# Altium schematic sheet RGMII_PHY.SchDoc: RGMII PHY
size A4; DrawnBy: ThanhQuoc; Revision: V01; SheetNumber: 19; SheetTotal: 21; Project: RV1126 CAMERA BOARD DESIGN; SPICEModelCachePFUVNJYO: <root> / <DocumentId>PFUVNJYO</DocumentId> / <CacheFrame Number="0"> / <Model Name="fb_220_adv" Kind="CKT"> / <Text>.SUBCKT FB_220_ADV 1 2 / Rdc 1 2 0.045 / * low freq inductive / L1 1 3 50n / R1 3 2 1 / * high freq loss / R2 1 2 200 / Cpar 1 2 2p / .ends FB_220_ADV</Text> / </Model> / </CacheFrame> / </root>
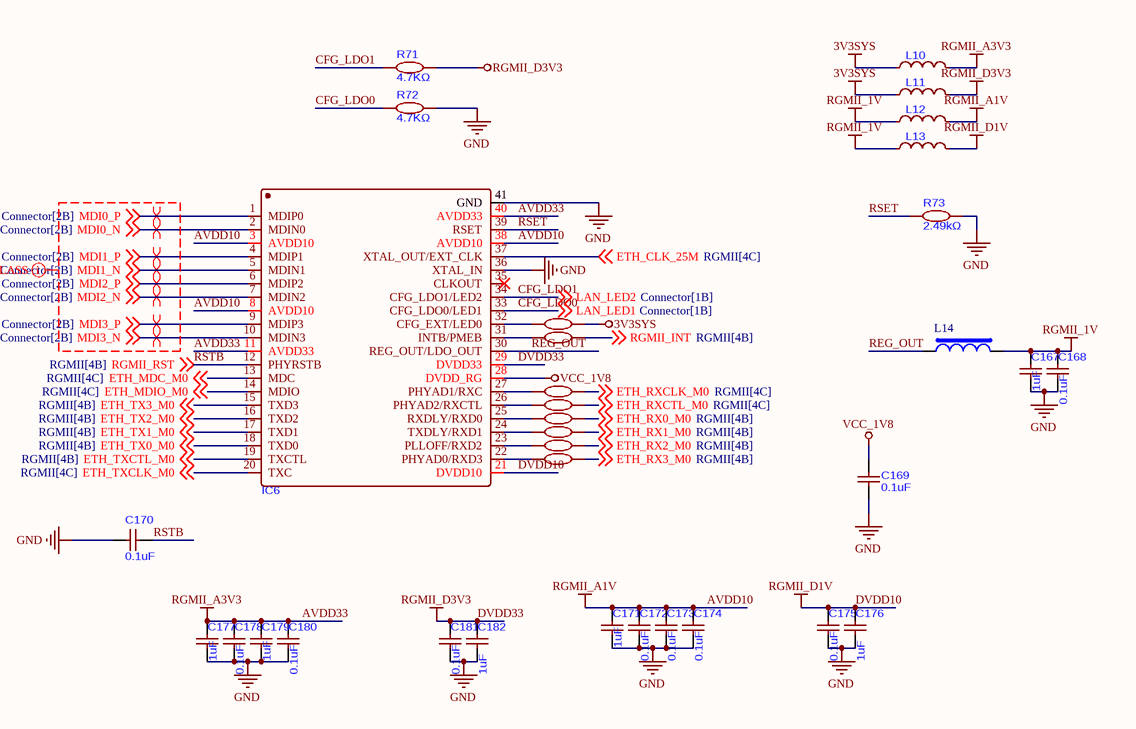
[diagram p0: RGMII_PHY.SchDoc]

## Parts
C167  1uF  [C0201]
C168  0.1uF  [C0201]
C169  0.1uF  [C0201]
C170  0.1uF  [C0201]
C171  1uF  [C0201]
C172  0.1uF  [C0201]
C173  0.1uF  [C0201]
C174  0.1uF  [C0201]
C175  0.1uF  [C0201]
C176  1uF  [C0201]
C177  1uF  [C0201]
C178  0.1uF  [C0201]
C179  1uF  [C0201]
C180  0.1uF  [C0201]
C181  0.1uF  [C0201]
C182  1uF  [C0201]
IC6  RTL8211F-CG  [WQFN-40_L5.0-W5.0-P0.4-BL-EP]  (value not drawn)
L10  FERRITE BEAD 120Ω 0201 1LN  [R0201]  (value not drawn)
L11  FERRITE BEAD 120Ω 0201 1LN  [R0201]  (value not drawn)
L12  FERRITE BEAD 120Ω 0201 1LN  [R0201]  (value not drawn)
L13  FERRITE BEAD 120Ω 0201 1LN  [R0201]  (value not drawn)
L14  PSTMAA252012-2R2MB  [IND_1008]  (value not drawn)
R71  4.7KΩ  [R0201]
R72  4.7KΩ  [R0201]
R73  2.49kΩ  [R0201]
R74  4.7KΩ  [R0201]  (value not drawn)
R75  0Ω  [R0201]  (value not drawn)
R76  22Ω  [R0201]  (value not drawn)
R77  22Ω  [R0201]  (value not drawn)
R78  22Ω  [R0201]  (value not drawn)
R79  22Ω  [R0201]  (value not drawn)
R80  22Ω  [R0201]  (value not drawn)
R81  22Ω  [R0201]  (value not drawn)

## Nets
3V3SYS: L10.1 L11.1 R74.2
AVDD10: C171.2 C172.2 C173.2 C174.2 IC6.3(AVDD10) IC6.8(AVDD10) IC6.38(AVDD10) L12.2  [also labelled RGMII_A1V]
AVDD33: C177.2 C178.2 C179.2 C180.2 IC6.11(AVDD33) IC6.40(AVDD33) L10.2  [also labelled RGMII_A3V3]
DVDD10: C175.2 C176.2 IC6.21(DVDD10) L13.2  [also labelled RGMII_D1V]
DVDD33: C181.2 C182.2 IC6.29(DVDD33) L11.2 R71.1  [also labelled RGMII_D3V3]
GND: C167.1 C168.1 C169.1 C170.2 C171.1 C172.1 C173.1 C174.1 C175.1 C176.1 C177.1 C178.1 C179.1 C180.1 C181.1 C182.1 IC6.36(XTAL_IN) IC6.41(GND) R72.1 R73.2
RGMII_1V: C167.2 C168.2 L12.1 L13.1 L14.2
VCC_1V8: C169.2 IC6.28(DVDD_RG)
CFG_LDO0: IC6.33(CFG_LDO0/LED1) R72.2 ; off-sheet LAN_LED1  [also labelled LAN_LED1]
CFG_LDO1: IC6.34(CFG_LDO1/LED2) R71.2 ; off-sheet LAN_LED2  [also labelled LAN_LED2]
ETH_CLK_25M: IC6.37(XTAL_OUT/EXT_CLK) ; off-sheet ETH_CLK_25M
ETH_MDC_M0: IC6.13(MDC) ; off-sheet ETH_MDC_M0
ETH_MDIO_M0: IC6.14(MDIO) ; off-sheet ETH_MDIO_M0
ETH_RX0_M0: R78.2 ; off-sheet ETH_RX0_M0
ETH_RX1_M0: R79.2 ; off-sheet ETH_RX1_M0
ETH_RX2_M0: R80.2 ; off-sheet ETH_RX2_M0
ETH_RX3_M0: R81.2 ; off-sheet ETH_RX3_M0
ETH_RXCLK_M0: R76.2 ; off-sheet ETH_RXCLK_M0
ETH_RXCTL_M0: R77.2 ; off-sheet ETH_RXCTL_M0
ETH_TX0_M0: IC6.18(TXD0) ; off-sheet ETH_TX0_M0
ETH_TX1_M0: IC6.17(TXD1) ; off-sheet ETH_TX1_M0
ETH_TX2_M0: IC6.16(TXD2) ; off-sheet ETH_TX2_M0
ETH_TX3_M0: IC6.15(TXD3) ; off-sheet ETH_TX3_M0
ETH_TXCLK_M0: IC6.20(TXC) ; off-sheet ETH_TXCLK_M0
ETH_TXCTL_M0: IC6.19(TXCTL) ; off-sheet ETH_TXCTL_M0
MDI0_N: IC6.2(MDIN0) ; off-sheet MDI0_N
MDI0_P: IC6.1(MDIP0) ; off-sheet MDI0_P
MDI1_N: IC6.5(MDIN1) ; off-sheet MDI1_N
MDI1_P: IC6.4(MDIP1) ; off-sheet MDI1_P
MDI2_N: IC6.7(MDIN2) ; off-sheet MDI2_N
MDI2_P: IC6.6(MDIP2) ; off-sheet MDI2_P
MDI3_N: IC6.10(MDIN3) ; off-sheet MDI3_N
MDI3_P: IC6.9(MDIP3) ; off-sheet MDI3_P
REG_OUT: IC6.30(REG_OUT/LDO_OUT) L14.1
RGMII_INT: R75.2 ; off-sheet RGMII_INT
RSET: IC6.39(RSET) R73.1
RSTB: C170.1 IC6.12(PHYRSTB) ; off-sheet RGMII_RST  [also labelled RGMII_RST]
NetIC6_22: IC6.22(PHYAD0/RXD3) R81.1
NetIC6_23: IC6.23(PLLOFF/RXD2) R80.1
NetIC6_24: IC6.24(TXDLY/RXD1) R79.1
NetIC6_25: IC6.25(RXDLY/RXD0) R78.1
NetIC6_26: IC6.26(PHYAD2/RXCTL) R77.1
NetIC6_27: IC6.27(PHYAD1/RXC) R76.1
NetIC6_31: IC6.31(INTB/PMEB) R75.1
NetIC6_32: IC6.32(CFG_EXT/LED0) R74.1

Not connected (* = marked no-connect by the designer): IC6 35(CLKOUT)*

## Layout directives
mark named DIFF_PHY_CLASS: MDI0_N, MDI0_P, MDI1_N, MDI1_P, MDI2_N, MDI2_P, MDI3_N, MDI3_P
differential pair; differential pair class PHY_DIFF_100: MDI0_N, MDI0_P, MDI1_N, MDI1_P, MDI2_N, MDI2_P, MDI3_N, MDI3_P

## Notes on the sheet
- Title:
- Drawn By:
- Page Contents:
- Checked By:
- Size:
- Date:
- File:
- License:
- Email:
- A4
- nguyenthanhquoc0206@gmail.com
- Number:
- Time:
- Revision:
- Sheet
- Website:
- of
- https://www.facebook.com/ntq.687

## Library data of the parts
C167 C171 C176 C177 C179 C182 = CAP_1uF-6.3V-10%-0201: 1uF ±10% 6.3V Ceramic Capacitor X5R 0201
C168-C170 C172-C175 C178 C180 C181 = CAP_100nF-6.3V-10%-0201_1: 0.1uF ±10% 6.3V Ceramic Capacitor X5R 0201
IC6 = RTL8211F-CG: Integrated 10/100/1000M Ethernet Precision Transceiver
L10-L13 = MPZ0603S121HT000: 120 Ohms @ 100MHz 1 Power Line Ferrite Bead 0201 1A 130mOhm
L14 = IND_2.2uH-4.1A-20%-1008: 2.2uH Shielded Wirewound Inductor 4.1A 60mOhm Max 1008 (2520 Metric); Manufacturer: Murata Electronics; Manufacturer Part Number: DFE252010P-R47M=P2; Case/Package: 1008; Supplier-1: Digikey
R71 R72 R74 = RES_4.7K-50mW-1%-0201: RES 4.7kΩ ±1% 50mW 0201; ComponentLink1Description: LCSC; ComponentLink1URL: https://www.lcsc.com/product-detail/C295718.html?s_z=n_q_t_120%2520OHM&spm=wm.fly.bg.5.xh___wm.ssy.tc.1.tz&lcsc_vid=EwRWBFZSQVIPVFdUTlJfVldeFFRYUFQAElRYBFRRE1MxVlNeRFZeU1BfTlBYVzsOAxUeFF5JWBYZEEoKFBINSQcJGk4eFQsCAgIaSgADAwAHC0slRVhcV1ZTT08GEwkK
R73 = RES_2.49K-0.05W-1%-0201: RES 2.49kΩ ±1% 50mW 0201; ComponentLink1Description: LCSC; ComponentLink1URL: https://www.lcsc.com/product-detail/C320826.html?spm=wm.fly.bg.3.xh&lcsc_vid=EwRWBFZSQVIPVFdUTlJfVldeFFRYUFQAElRYBFRRE1MxVlNeRFdcXlNfT1JZVDsOAxUeFF5JWBYZEEoKFBINSQcJGk4eFQsCAgIaSgADAwAHC0slRlRbUFBVWQkaCgg%3D
R75 = RES_0OHM-50mW-1%-0201: RES 0Ω ±1% 50mW 0201; ComponentLink1Description: LCSC; ComponentLink1URL: https://www.lcsc.com/product-detail/C295718.html?s_z=n_q_t_120%2520OHM&spm=wm.fly.bg.5.xh___wm.ssy.tc.1.tz&lcsc_vid=EwRWBFZSQVIPVFdUTlJfVldeFFRYUFQAElRYBFRRE1MxVlNeRFZeU1BfTlBYVzsOAxUeFF5JWBYZEEoKFBINSQcJGk4eFQsCAgIaSgADAwAHC0slRVhcV1ZTT08GEwkK
R76-R81 = RES_22-50mW-1%-0201: RES 22Ω ±1% 50mW 0201; ComponentLink1Description: LCSC; ComponentLink1URL: https://www.lcsc.com/product-detail/C295718.html?s_z=n_q_t_120%2520OHM&spm=wm.fly.bg.5.xh___wm.ssy.tc.1.tz&lcsc_vid=EwRWBFZSQVIPVFdUTlJfVldeFFRYUFQAElRYBFRRE1MxVlNeRFZeU1BfTlBYVzsOAxUeFF5JWBYZEEoKFBINSQcJGk4eFQsCAgIaSgADAwAHC0slRVhcV1ZTT08GEwkK